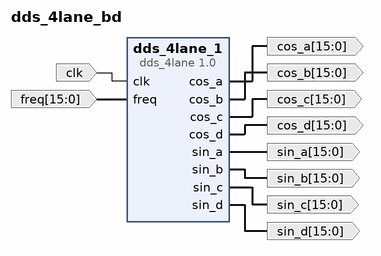
[diagram p0: block diagram of the top level]
# Vivado block design dds_4lane_bd, xc7k160tfbg484-2, Vivado 2021.2
create_bd_design dds_4lane_bd

create_bd_port -dir I -type clk clk
create_bd_port -dir O -from 15 -to 0 -type data cos_a
create_bd_port -dir O -from 15 -to 0 -type data cos_b
create_bd_port -dir O -from 15 -to 0 -type data cos_c
create_bd_port -dir O -from 15 -to 0 -type data cos_d
create_bd_port -dir I -from 15 -to 0 -type data freq
create_bd_port -dir O -from 15 -to 0 -type data sin_a
create_bd_port -dir O -from 15 -to 0 -type data sin_b
create_bd_port -dir O -from 15 -to 0 -type data sin_c
create_bd_port -dir O -from 15 -to 0 -type data sin_d

create_bd_cell -type ip -vlnv User_Company:SysGen:dds_4lane:1.0 dds_4lane_1

# ---- connections ----

connect_bd_net [get_bd_ports clk] [get_bd_pins dds_4lane_1/clk]
connect_bd_net [get_bd_pins dds_4lane_1/cos_a] [get_bd_ports cos_a]
connect_bd_net [get_bd_pins dds_4lane_1/cos_b] [get_bd_ports cos_b]
connect_bd_net [get_bd_pins dds_4lane_1/cos_c] [get_bd_ports cos_c]
connect_bd_net [get_bd_pins dds_4lane_1/cos_d] [get_bd_ports cos_d]
connect_bd_net [get_bd_pins dds_4lane_1/sin_a] [get_bd_ports sin_a]
connect_bd_net [get_bd_pins dds_4lane_1/sin_b] [get_bd_ports sin_b]
connect_bd_net [get_bd_pins dds_4lane_1/sin_c] [get_bd_ports sin_c]
connect_bd_net [get_bd_pins dds_4lane_1/sin_d] [get_bd_ports sin_d]
connect_bd_net [get_bd_ports freq] [get_bd_pins dds_4lane_1/freq]

validate_bd_design
save_bd_design
